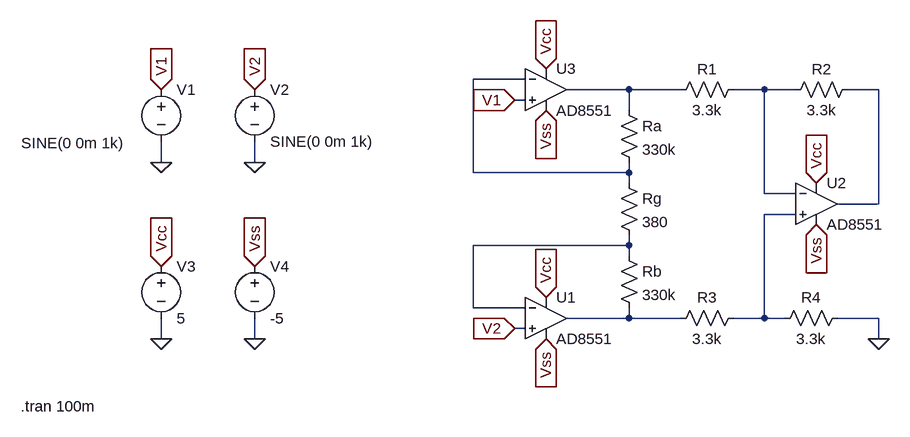
[diagram p0: schematic Simulacion Balanza.asc]
Simulacion Balanza.asc, the LTspice schematic file:
Version 4.1
SHEET 1 880 680
WIRE 176 48 96 48
WIRE 336 64 240 64
WIRE 416 64 336 64
WIRE 544 64 496 64
WIRE 592 64 544 64
WIRE 720 64 672 64
WIRE 176 80 160 80
WIRE 336 96 336 64
WIRE -384 176 -384 144
WIRE -240 176 -240 144
WIRE 96 192 96 48
WIRE 336 192 336 176
WIRE 336 192 96 192
WIRE 336 208 336 192
WIRE 544 224 544 64
WIRE 592 224 544 224
WIRE 720 240 720 64
WIRE 720 240 656 240
WIRE 592 256 544 256
WIRE 336 304 336 288
WIRE 336 304 96 304
WIRE 336 320 336 304
WIRE 96 400 96 304
WIRE 176 400 96 400
WIRE 336 416 336 400
WIRE 336 416 240 416
WIRE 416 416 336 416
WIRE 544 416 544 256
WIRE 544 416 496 416
WIRE 576 416 544 416
WIRE 720 416 656 416
WIRE 176 432 160 432
WIRE -384 448 -384 416
WIRE -240 448 -240 416
WIRE 720 448 720 416
FLAG 720 448 0
FLAG 208 32 Vcc
IOPIN 208 32 In
FLAG 624 208 Vcc
IOPIN 624 208 In
FLAG 208 384 Vcc
IOPIN 208 384 In
FLAG 208 448 Vss
IOPIN 208 448 In
FLAG 208 96 Vss
IOPIN 208 96 In
FLAG 624 272 Vss
IOPIN 624 272 In
FLAG 160 432 V2
IOPIN 160 432 In
FLAG 160 80 V1
IOPIN 160 80 In
FLAG -384 64 V1
IOPIN -384 64 In
FLAG -240 64 V2
IOPIN -240 64 In
FLAG -384 176 0
FLAG -240 176 0
FLAG -384 448 0
FLAG -240 448 0
FLAG -384 336 Vcc
IOPIN -384 336 In
FLAG -240 336 Vss
IOPIN -240 336 In
SYMBOL OpAmps\\AD8551 208 0 R0
SYMATTR InstName U3
SYMBOL OpAmps\\AD8551 208 352 R0
SYMATTR InstName U1
SYMBOL OpAmps\\AD8551 624 176 R0
SYMATTR InstName U2
SYMBOL res 512 48 R90
WINDOW 0 0 56 VBottom 2
WINDOW 3 32 56 VTop 2
SYMATTR InstName R1
SYMATTR Value 3.3k
SYMBOL res 688 48 R90
WINDOW 0 0 56 VBottom 2
WINDOW 3 32 56 VTop 2
SYMATTR InstName R2
SYMATTR Value 3.3k
SYMBOL res 512 400 R90
WINDOW 0 0 56 VBottom 2
WINDOW 3 32 56 VTop 2
SYMATTR InstName R3
SYMATTR Value 3.3k
SYMBOL res 672 400 R90
WINDOW 0 0 56 VBottom 2
WINDOW 3 32 56 VTop 2
SYMATTR InstName R4
SYMATTR Value 3.3k
SYMBOL res 320 192 R0
SYMATTR InstName Rg
SYMATTR Value 380
SYMBOL res 320 304 R0
SYMATTR InstName Rb
SYMATTR Value 330k
SYMBOL res 320 80 R0
SYMATTR InstName Ra
SYMATTR Value 330k
SYMBOL voltage -384 48 R0
WINDOW 3 -215 98 Left 2
WINDOW 123 0 0 Left 0
WINDOW 39 0 0 Left 0
SYMATTR InstName V1
SYMATTR Value SINE(0 0m 1k)
SYMBOL voltage -240 48 R0
WINDOW 123 0 0 Left 0
WINDOW 39 0 0 Left 0
SYMATTR InstName V2
SYMATTR Value SINE(0 0m 1k)
SYMBOL voltage -384 320 R0
SYMATTR InstName V3
SYMATTR Value 5
SYMBOL voltage -240 320 R0
SYMATTR InstName V4
SYMATTR Value -5
TEXT -600 552 Left 2 !.tran 100m

The netlist it stands for:
* Simulacion Balanza.asc
X§U3 V1 N001 Vcc Vss N002 AD8551  ; pins In+ In- V+ V- OUT
X§U1 V2 N006 Vcc Vss N007 AD8551  ; pins In+ In- V+ V- OUT
X§U2 N005 N003 Vcc Vss N004 AD8551  ; pins In+ In- V+ V- OUT
R1 N003 N002 3.3k
R2 N004 N003 3.3k
R3 N005 N007 3.3k
R4 0 N005 3.3k
Rg N001 N006 380
Rb N006 N007 330k
Ra N002 N001 330k
V1 V1 0 SINE(0 0m 1k)
V2 V2 0 SINE(0 0m 1k)
V3 Vcc 0 5
V4 Vss 0 -5
.tran 100m
.backanno
.end